# Altium schematic sheet Main.SchDoc
size B
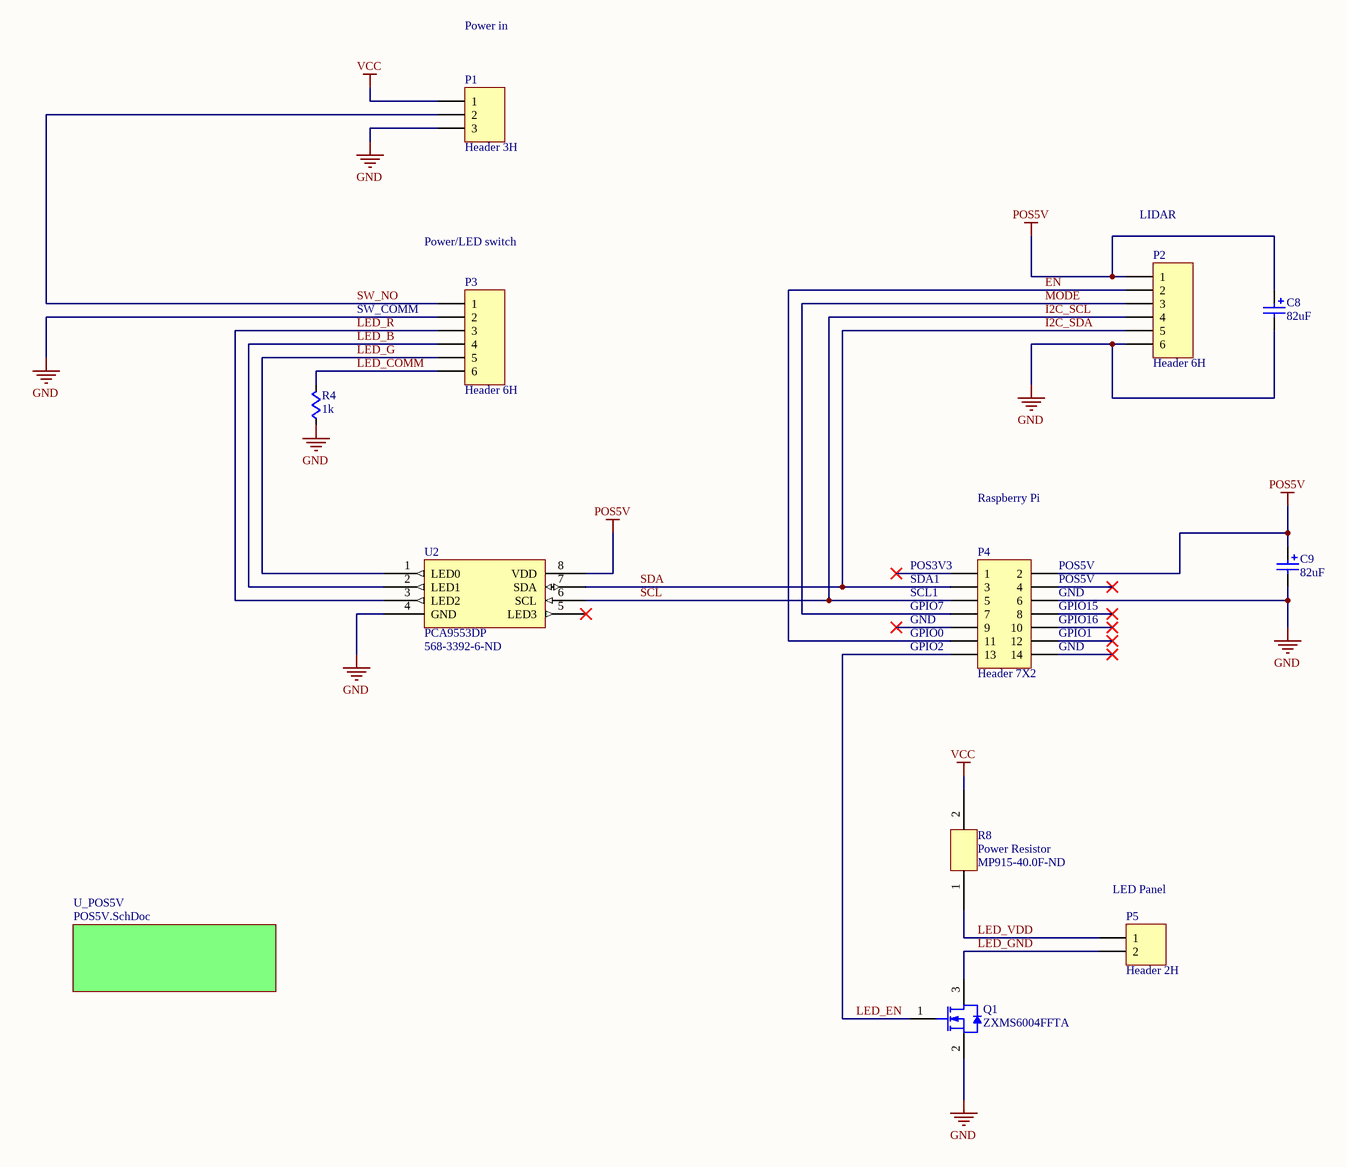
[diagram p0: Main.SchDoc]

## Parts
C8  value 82uF  [CAP_EEFK_D8]  (hidden comment: EEEFK1V680XP)
C9  value 82uF  [CAP_EEFK_D8]  (hidden comment: EEEFK1V680XP)
P1  Header 3H  [HDR1X3H]
P2  Header 6H  [HDR1X6H]
P3  Header 6H  [HDR1X6H]
P4  Header 7X2  [HDR2X7]
P5  Header 2H  [HDR1X2H]
Q1  ZXMS6004FFTA  [DIOD-SOT23F-3_V]
R4  value 1k  [R0805]  (hidden comment: Res)
R8  Power Resistor  Supplier Part Number 1: MP915-40.0F-ND  [MP915]
U2  PCA9553DP  Supplier Part Number 1: 568-3392-6-ND  [TSSOP8]

## Sub-sheets
U_POS5V = POS5V.SchDoc: no entries

## Nets
GND: C8.2 C9.2 P1.3 P2.6 P3.2 P4.6 Q1.2(S) R4.1 U2.4(GND)
POS5V: C8.1 C9.1 P2.1 P4.2 U2.8(VDD)
VCC: P1.1 R8.2
EN: P2.2 P4.11
I2C_SCL: P2.4 P4.5 U2.6(SCL)  [also labelled SCL]
I2C_SDA: P2.5 P4.3 U2.7(SDA)  [also labelled SDA]
LED_B: P3.4 U2.2(LED1)
LED_COMM: P3.6 R4.2
LED_EN: P4.13 Q1.1(G)
LED_G: P3.5 U2.1(LED0)
LED_GND: P5.2 Q1.3(D)
LED_R: P3.3 U2.3(LED2)
LED_VDD: P5.1 R8.1
MODE: P2.3 P4.7
SW_NO: P1.2 P3.1

Not connected (* = marked no-connect by the designer): P4 1* 4* 8* 9* 10* 12* 14*; U2 5(LED3)*

## Notes on the sheet
- Power in
- Power/LED switch
- LIDAR
- SW_COMM
- Raspberry Pi
- (near P4) POS3V3
- (near P4) SDA1
- (near P4) POS5V
- (near P4) GND
- (near P4) SCL1
- (near P4) GPIO7
- (near P4) GPIO0
- (near P4) GPIO2
- (near P4) GPIO1
- (near P4) GPIO15
- (near P4) GPIO16
- (near P5) LED Panel

## Library data of the parts
C8 C9 = EEEFK1V680XP: Polarized Capacitor (Surface Mount); Vendor: Panasonic; Built_By: EMA_UL_Team; C: Copyright (C) 2015 Accelerated Designs. All rights reserved; Manufacturer_Part_Number: EEEFK1V680XP; Supplier 1: Digi-Key; Supplier Part Number 1: P18960DKR-ND
P1 = Header 3H: Header, 3-Pin, Right Angle; LatestRevisionDate: 17-Jul-2002; LatestRevisionNote: Re-released for DXP Platform.; Publisher: Altium Limited
P2 P3 = Header 6H: Header, 6-Pin, Right Angle; LatestRevisionDate: 17-Jul-2002; LatestRevisionNote: Re-released for DXP Platform.; Publisher: Altium Limited
P4 = Header 7X2: Header, 7-Pin, Dual row; LatestRevisionDate: 17-Jul-2002; LatestRevisionNote: Re-released for DXP Platform.; Publisher: Altium Limited
P5 = Header 2H: Header, 2-Pin, Right Angle; LatestRevisionDate: 17-Jul-2002; LatestRevisionNote: Re-released for DXP Platform.; Publisher: Altium Limited
Q1 = CMP-2000-07435-1: N-Channel Self Protected Enhancement Mode Intellifet(TM) MOSFET, 60 V, 1.3 A, -40 to 150 degC, 3-Pin SOT23, RoHS, Tape and Reel; Manufacturer: Diodes Inc; Voltage - Load: 60V(Max); Current - Output (Max): 1.3A; Featured Product: ZXMS6004FF60VN-ChannelMOSFET; Product Training Modules: IntelliFET's; Rds On (Typ): 350mOhm; Input Type: Non-Inverting; Interface: On/Off; Number of Outputs: 1; Ratio - Input: Output:1:1; Output Configuration: LowSide; Voltage - Supply (Vcc/Vdd): 3.3V,5V; PCN Design/Specification: PartMarkingUpdate25/Sep/2015; Switch Type: GeneralPurpose; Fault Protection: CurrentLimiting(Fixed),OverTemperature,OverVoltage; Other Names: ZXMS6004FFTR; Category: IntegratedCircuits(ICs); Operating Temperature: -40°C~150°C(TJ); Features: AutoRestart; Manufacturer URL: http://www.diodes.com/; Datasheet URL: https://datasheet.ciiva.com/15109/getdatasheetpartid-411522-15109086.pdf; Package Reference: SOT23F-3; Family: PMIC-PowerDistributionSwitches,LoadDrivers; Package Description: 3-Pin Small Outline Transistor Flat Lead, Body 2.9 x 1.6 mm, Pitch 0.95 mm; Output Type: N-Channel; Supplier Device Package: SOT-23F; RoHS Information: RoHSCertofCompliance; Package / Case: SOT-23-3FlatLeads; Packaging: Tape&Reel(TR); Datasheet Version: Rev. 6-2, 10/2014; Mounting Technology: SurfaceMount; Series: Automotive,AEC-Q101,INTELLIFET®; Online Catalog: GeneralPurpose; Standard Package: 3,000
R4 = Res: resistor
R8 = MP915-40.0-1%: Supplier 1: Digi-Key
U2 = PCA9553DP: LED Driver, I2C; Supplier 1: Digi-Key